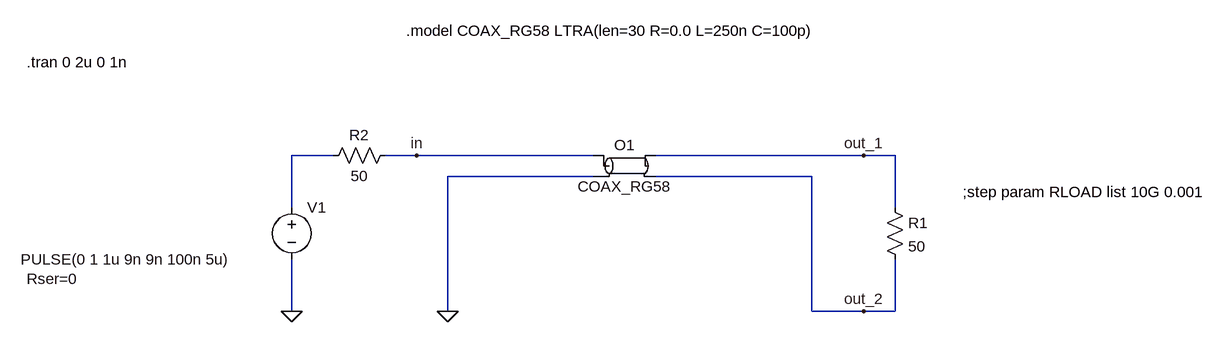
[diagram p0: schematic coaxial_cable_delay.asc]
coaxial_cable_delay.asc, the LTspice schematic file:
Version 4
SHEET 1 1332 680
WIRE -272 128 -336 128
WIRE -144 128 -192 128
WIRE 128 128 -144 128
WIRE 544 128 224 128
WIRE 592 128 544 128
WIRE 128 160 -96 160
WIRE 464 160 224 160
WIRE -336 208 -336 128
WIRE 592 208 592 128
WIRE -336 368 -336 288
WIRE -96 368 -96 160
WIRE 464 368 464 160
WIRE 544 368 464 368
WIRE 592 368 592 288
WIRE 592 368 544 368
FLAG -336 368 0
FLAG -96 368 0
FLAG 544 128 out_1
FLAG -144 128 in
FLAG 544 368 out_2
SYMBOL res 576 192 R0
SYMATTR InstName R1
SYMATTR Value 50
SYMBOL voltage -336 192 R0
WINDOW 3 -417 96 Left 2
WINDOW 123 0 0 Left 0
WINDOW 39 -408 126 Left 2
SYMATTR Value PULSE(0 1 1u 9n 9n 100n 5u)
SYMATTR SpiceLine Rser=0
SYMATTR InstName V1
SYMBOL ltline 176 144 R0
SYMATTR InstName O1
SYMATTR Value COAX_RG58
SYMBOL res -176 112 R90
WINDOW 0 0 56 VBottom 2
WINDOW 3 32 56 VTop 2
SYMATTR InstName R2
SYMATTR Value 50
TEXT -160 -64 Left 2 !.model COAX_RG58 LTRA(len=30 R=0.0 L=250n C=100p)
TEXT -744 -16 Left 2 !.tran 0 2u 0 1n
TEXT 696 184 Left 2 !;step param RLOAD list 10G 0.001

The netlist it stands for:
* coaxial_cable_delay.asc
R1 out_1 out_2 50
V1 N001 0 PULSE(0 1 1u 9n 9n 100n 5u) Rser=0
O1 in 0 out_1 out_2 COAX_RG58
R2 in N001 50
.model COAX_RG58 LTRA(len=30 R=0.0 L=250n C=100p)
.tran 0 2u 0 1n
;step param RLOAD list 10G 0.001
.backanno
.end